# EAGLE schematic A314v1.1 (EAGLE 7.7.0)

## Sheet 1 of 4: AMIGA Interface
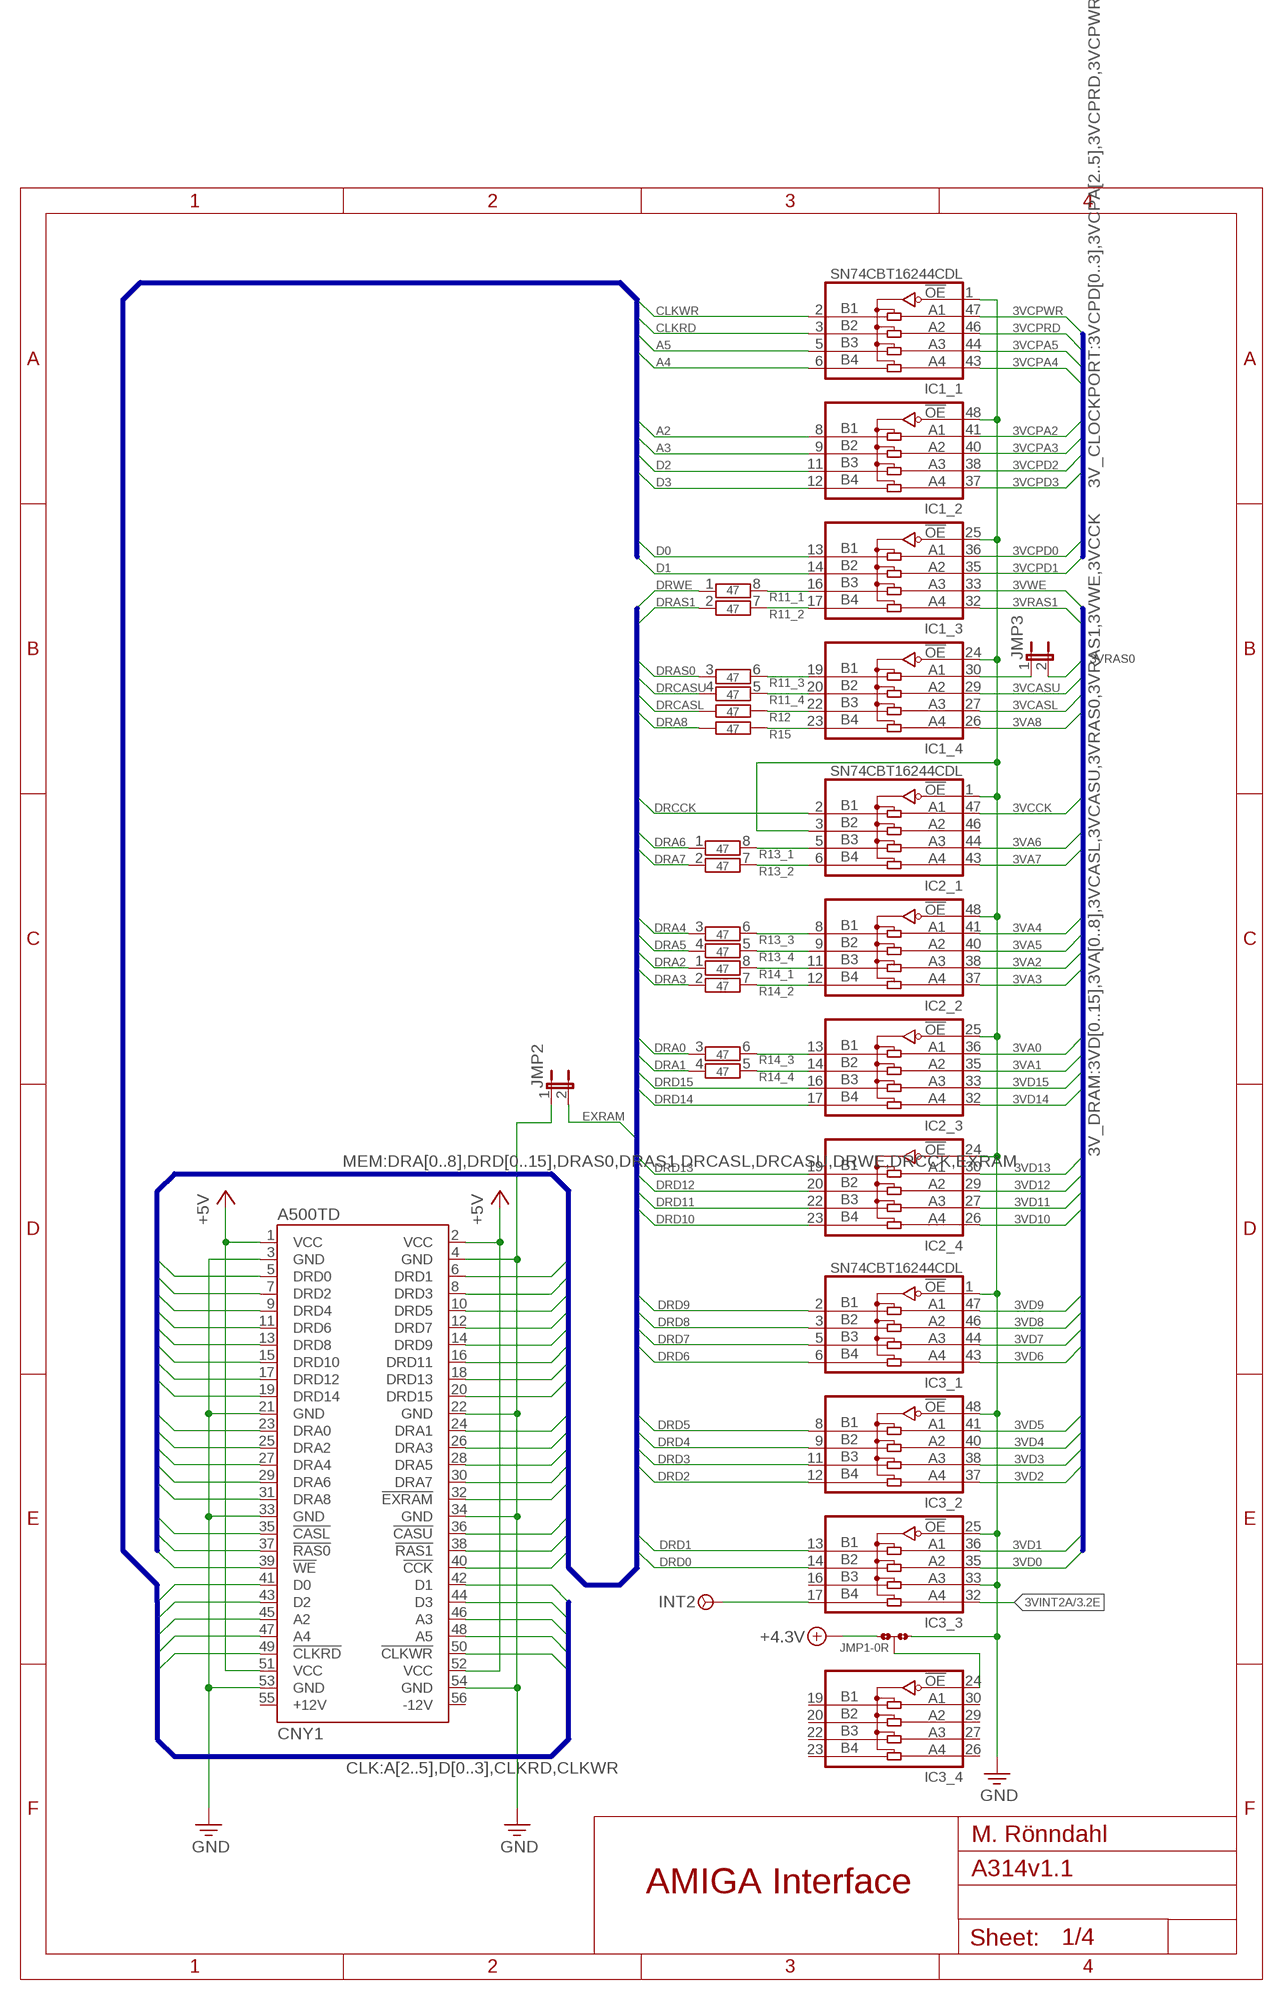
[diagram p0: schematic, sheet 1]

### Parts
CNY1  A500TD  [TRAPDOOR]
IC1  SN74CBT16244CDL  [SSOP-DL48]
IC2  SN74CBT16244CDL  [SSOP-DL48]
IC3  SN74CBT16244CDL  [SSOP-DL48]
INT2  TP1  TP_LITE  [P1-08]
JMP1  0R-JUMPC  [C0R-JMP]
JMP2  JP1E  [JP1]
JMP3  JP1E  [JP1]
R11  47  CTS742C083_S  [CTS742C083]
R12  47  R-EU_R0805  [R0805]
R13  47  CTS742C083_S  [CTS742C083]
R14  47  CTS742C083_S  [CTS742C083]
R15  47  R-EU_R0805  [R0805]

### Nets
3VA0: IC2.36(_3:A1) ; also sheet 3
3VA1: IC2.35(_3:A2) ; also sheet 3
3VA2: IC2.38(_2:A3) ; also sheet 3
3VA3: IC2.37(_2:A4) ; also sheet 3
3VA4: IC2.41(_2:A1) ; also sheet 3
3VA5: IC2.40(_2:A2) ; also sheet 3
3VA6: IC2.44(_1:A3) ; also sheet 3
3VA7: IC2.43(_1:A4) ; also sheet 3
3VA8: IC1.26(_4:A4) ; also sheet 3
3VCASL: IC1.27(_4:A3) ; also sheet 3
3VCASU: IC1.29(_4:A2) ; also sheet 3
3VCCK: IC2.47(_1:A1) ; also sheet 3
3VCPA2: IC1.41(_2:A1) ; also sheet 3
3VCPA3: IC1.40(_2:A2) ; also sheet 3
3VCPA4: IC1.43(_1:A4) ; also sheet 3
3VCPA5: IC1.44(_1:A3) ; also sheet 3
3VCPD0: IC1.36(_3:A1) ; also sheet 3
3VCPD1: IC1.35(_3:A2) ; also sheet 3
3VCPD2: IC1.38(_2:A3) ; also sheet 3
3VCPD3: IC1.37(_2:A4) ; also sheet 3
3VCPRD: IC1.46(_1:A2) ; also sheet 3
3VCPWR: IC1.47(_1:A1) ; also sheet 3
3VD0: IC3.35(_3:A2) ; also sheet 3
3VD1: IC3.36(_3:A1) ; also sheet 3
3VD2: IC3.37(_2:A4) ; also sheet 3
3VD3: IC3.38(_2:A3) ; also sheet 3
3VD4: IC3.40(_2:A2) ; also sheet 3
3VD5: IC3.41(_2:A1) ; also sheet 3
3VD6: IC3.43(_1:A4) ; also sheet 3
3VD7: IC3.44(_1:A3) ; also sheet 3
3VD8: IC3.46(_1:A2) ; also sheet 3
3VD9: IC3.47(_1:A1) ; also sheet 3
3VD10: IC2.26(_4:A4) ; also sheet 3
3VD11: IC2.27(_4:A3) ; also sheet 3
3VD12: IC2.29(_4:A2) ; also sheet 3
3VD13: IC2.30(_4:A1) ; also sheet 3
3VD14: IC2.32(_3:A4) ; also sheet 3
3VD15: IC2.33(_3:A3) ; also sheet 3
3VINT2A: IC3.32(_3:A4) ; also sheet 3
3VRAS0: JMP3.2 ; also sheet 3
3VRAS1: IC1.32(_3:A4) ; also sheet 3
3VWE: IC1.33(_3:A3) ; also sheet 3
+4.3V: IC3.24(_4:!OE) JMP1.1 JMP1.2 ; also sheet 4
+5V: CNY1.1(VCC) CNY1.2(VCC) CNY1.51(VCC) CNY1.52(VCC) ; also sheet 4
A2: CNY1.45(A2) IC1.8(_2:B1)
A3: CNY1.46(A3) IC1.9(_2:B2)
A4: CNY1.47(A4) IC1.6(_1:B4)
A5: CNY1.48(A5) IC1.5(_1:B3)
CLKRD: CNY1.49(!CLKRD) IC1.3(_1:B2)
CLKWR: CNY1.50(!CLKWR) IC1.2(_1:B1)
D0: CNY1.41(D0) IC1.13(_3:B1)
D1: CNY1.42(D1) IC1.14(_3:B2)
D2: CNY1.43(D2) IC1.11(_2:B3)
D3: CNY1.44(D3) IC1.12(_2:B4)
DRA0: CNY1.23(DRA0) R14.3
DRA1: CNY1.24(DRA1) R14.4
DRA2: CNY1.25(DRA2) R14.1
DRA3: CNY1.26(DRA3) R14.2
DRA4: CNY1.27(DRA4) R13.3
DRA5: CNY1.28(DRA5) R13.4
DRA6: CNY1.29(DRA6) R13.1
DRA7: CNY1.30(DRA7) R13.2
DRA8: CNY1.31(DRA8) R15.2
DRA8_L: IC1.23(_4:B4) R15.1
DRAS0: CNY1.37(!RAS0) R11.3
DRAS0_L: IC1.19(_4:B1) R11.6
DRAS1: CNY1.38(!RAS1) R11.2
DRAS1_L: IC1.17(_3:B4) R11.7
DRCASL: CNY1.35(!CASL) R12.2
DRCASL_L: IC1.22(_4:B3) R12.1
DRCASU: CNY1.36(!CASU) R11.4
DRCASU_L: IC1.20(_4:B2) R11.5
DRCCK: CNY1.40(!CCK) IC2.2(_1:B1)
DRD0: CNY1.5(DRD0) IC3.14(_3:B2)
DRD1: CNY1.6(DRD1) IC3.13(_3:B1)
DRD2: CNY1.7(DRD2) IC3.12(_2:B4)
DRD3: CNY1.8(DRD3) IC3.11(_2:B3)
DRD4: CNY1.9(DRD4) IC3.9(_2:B2)
DRD5: CNY1.10(DRD5) IC3.8(_2:B1)
DRD6: CNY1.11(DRD6) IC3.6(_1:B4)
DRD7: CNY1.12(DRD7) IC3.5(_1:B3)
DRD8: CNY1.13(DRD8) IC3.3(_1:B2)
DRD9: CNY1.14(DRD9) IC3.2(_1:B1)
DRD10: CNY1.15(DRD10) IC2.23(_4:B4)
DRD11: CNY1.16(DRD11) IC2.22(_4:B3)
DRD12: CNY1.17(DRD12) IC2.20(_4:B2)
DRD13: CNY1.18(DRD13) IC2.19(_4:B1)
DRD14: CNY1.19(DRD14) IC2.17(_3:B4)
DRD15: CNY1.20(DRD15) IC2.16(_3:B3)
DRWE: CNY1.39(!WE) R11.1
DRWE_L: IC1.16(_3:B3) R11.8
EXRAM: CNY1.32(!EXRAM) JMP2.2
GND: CNY1.3(GND) CNY1.4(GND) CNY1.21(GND) CNY1.22(GND) CNY1.33(GND) CNY1.34(GND) CNY1.53(GND) CNY1.54(GND) IC1.1(_1:!OE) IC1.24(_4:!OE) IC1.25(_3:!OE) IC1.48(_2:!OE) IC2.1(_1:!OE) IC2.3(_1:B2) IC2.24(_4:!OE) IC2.25(_3:!OE) IC2.48(_2:!OE) IC3.1(_1:!OE) IC3.25(_3:!OE) IC3.33(_3:A3) IC3.48(_2:!OE) JMP1.3 JMP2.1 ; also sheet 2,3,4
INT2A: IC3.17(_3:B4) INT2.TP
N$5: IC1.30(_4:A1) JMP3.1
N$9: IC2.14(_3:B2) R14.5
N$10: IC2.13(_3:B1) R14.6
N$11: IC2.12(_2:B4) R14.7
N$12: IC2.11(_2:B3) R14.8
N$13: IC2.9(_2:B2) R13.5
N$14: IC2.8(_2:B1) R13.6
N$15: IC2.6(_1:B4) R13.7
N$16: IC2.5(_1:B3) R13.8
Unconnected: CNY1.55(+12V) CNY1.56(-12V) IC2.46(_1:A2) IC3.16(_3:B3) IC3.19(_4:B1) IC3.20(_4:B2) IC3.22(_4:B3) IC3.23(_4:B4) IC3.26(_4:A4) IC3.27(_4:A3) IC3.29(_4:A2) IC3.30(_4:A1)

### Buses
CLK:A[2..5],D[0..3],CLKRD,CLKWR
MEM:DRA[0..8],DRD[0..15],DRAS0,DRAS1,DRCASL,DRCASU,DRWE,DRCCK,EXRAM
3V_DRAM:3VD[0..15],3VA[0..8],3VCASL,3VCASU,3VRAS0,3VRAS1,3VWE,3VCCK
3V_CLOCKPORT:3VCPD[0..3],3VCPA[2..5],3VCPRD,3VCPWR

### Notes on the sheet
- M. Rönndahl
- AMIGA Interface

## Sheet 2 of 4: SRAM & RTC
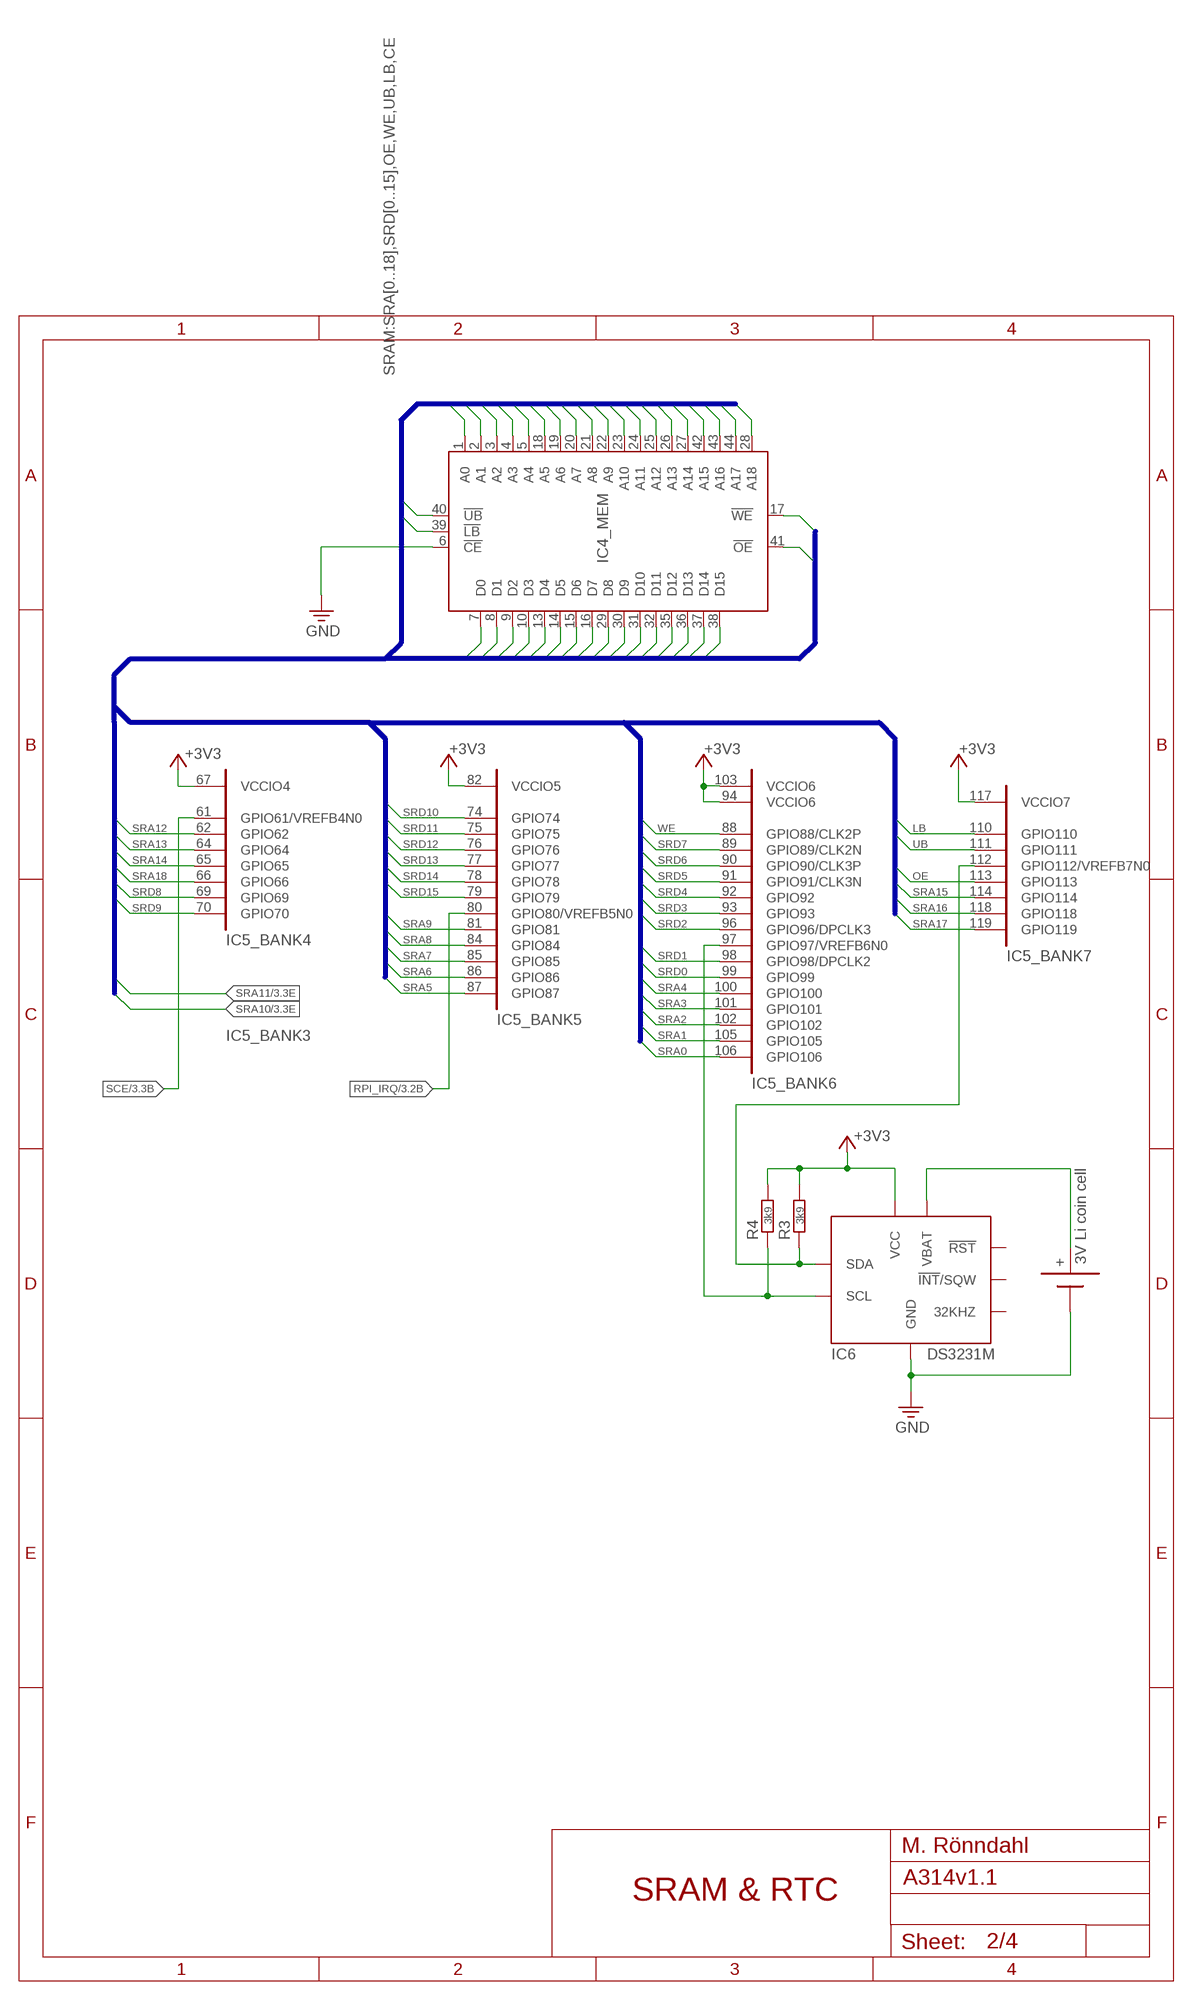
[diagram p1: schematic, sheet 2]

### Parts
BAT1  CR2025/CR2032TH  [LINX20XX-THM]
IC4  IS61WV51216BLL-10TLI  [TSOP-2]
IC5  10M08SCE144  [SQFP-S-20X20-144]
IC6  DS3231M  [SOIC8]
R3  3k9  R-EU_R0805  [R0805]
R4  3k9  R-EU_R0805  [R0805]

### Nets
+: BAT1.+@1(+) BAT1.+@2(+) BAT1.+@3(+) BAT1.+@4(+) IC6.6(VBAT)
+3V3: IC5.67(_BANK4:VCCIO4) IC5.82(_BANK5:VCCIO5) IC5.94(_BANK6:VCCIO6) IC5.103(_BANK6:VCCIO6) IC5.117(_BANK7:VCCIO7) IC6.2(VCC) R3.2 R4.2 ; also sheet 3,4
GND: BAT1.GND(-) IC4.6(_MEM:!CE) IC6.5(GND) ; also sheet 1,3,4
LB: IC4.39(_MEM:!LB) IC5.110(_BANK7:GPIO110)
OE: IC4.41(_MEM:!OE) IC5.113(_BANK7:GPIO113)
RPI_IRQ: IC5.80(_BANK5:GPIO80/VREFB5N0) ; also sheet 3
SCE: IC5.61(_BANK4:GPIO61/VREFB4N0) ; also sheet 3
SCL: IC5.97(_BANK6:GPIO97/VREFB6N0) IC6.8(SCL) R4.1
SDA: IC5.112(_BANK7:GPIO112/VREFB7N0) IC6.7(SDA) R3.1
SRA0: IC4.1(_MEM:A0) IC5.106(_BANK6:GPIO106)
SRA1: IC4.2(_MEM:A1) IC5.105(_BANK6:GPIO105)
SRA2: IC4.3(_MEM:A2) IC5.102(_BANK6:GPIO102)
SRA3: IC4.4(_MEM:A3) IC5.101(_BANK6:GPIO101)
SRA4: IC4.5(_MEM:A4) IC5.100(_BANK6:GPIO100)
SRA5: IC4.18(_MEM:A5) IC5.87(_BANK5:GPIO87)
SRA6: IC4.19(_MEM:A6) IC5.86(_BANK5:GPIO86)
SRA7: IC4.20(_MEM:A7) IC5.85(_BANK5:GPIO85)
SRA8: IC4.21(_MEM:A8) IC5.84(_BANK5:GPIO84)
SRA9: IC4.22(_MEM:A9) IC5.81(_BANK5:GPIO81)
SRA10: IC4.23(_MEM:A10) ; also sheet 3
SRA11: IC4.24(_MEM:A11) ; also sheet 3
SRA12: IC4.25(_MEM:A12) IC5.62(_BANK4:GPIO62)
SRA13: IC4.26(_MEM:A13) IC5.64(_BANK4:GPIO64)
SRA14: IC4.27(_MEM:A14) IC5.65(_BANK4:GPIO65)
SRA15: IC4.42(_MEM:A15) IC5.114(_BANK7:GPIO114)
SRA16: IC4.43(_MEM:A16) IC5.118(_BANK7:GPIO118)
SRA17: IC4.44(_MEM:A17) IC5.119(_BANK7:GPIO119)
SRA18: IC4.28(_MEM:A18) IC5.66(_BANK4:GPIO66)
SRD0: IC4.7(_MEM:D0) IC5.99(_BANK6:GPIO99)
SRD1: IC4.8(_MEM:D1) IC5.98(_BANK6:GPIO98/DPCLK2)
SRD2: IC4.9(_MEM:D2) IC5.96(_BANK6:GPIO96/DPCLK3)
SRD3: IC4.10(_MEM:D3) IC5.93(_BANK6:GPIO93)
SRD4: IC4.13(_MEM:D4) IC5.92(_BANK6:GPIO92)
SRD5: IC4.14(_MEM:D5) IC5.91(_BANK6:GPIO91/CLK3N)
SRD6: IC4.15(_MEM:D6) IC5.90(_BANK6:GPIO90/CLK3P)
SRD7: IC4.16(_MEM:D7) IC5.89(_BANK6:GPIO89/CLK2N)
SRD8: IC4.29(_MEM:D8) IC5.69(_BANK4:GPIO69)
SRD9: IC4.30(_MEM:D9) IC5.70(_BANK4:GPIO70)
SRD10: IC4.31(_MEM:D10) IC5.74(_BANK5:GPIO74)
SRD11: IC4.32(_MEM:D11) IC5.75(_BANK5:GPIO75)
SRD12: IC4.35(_MEM:D12) IC5.76(_BANK5:GPIO76)
SRD13: IC4.36(_MEM:D13) IC5.77(_BANK5:GPIO77)
SRD14: IC4.37(_MEM:D14) IC5.78(_BANK5:GPIO78)
SRD15: IC4.38(_MEM:D15) IC5.79(_BANK5:GPIO79)
UB: IC4.40(_MEM:!UB) IC5.111(_BANK7:GPIO111)
WE: IC4.17(_MEM:!WE) IC5.88(_BANK6:GPIO88/CLK2P)
Unconnected: IC6.1(32KHZ) IC6.3(!INT!/SQW) IC6.4(!RST)

### Buses
SRAM:SRA[0..18],SRD[0..15],OE,WE,UB,LB,CE

### Notes on the sheet
- IC5_BANK3
- 3V Li coin cell
- M. Rönndahl
- SRAM & RTC

## Sheet 3 of 4: Raspberry & DRAM Bus
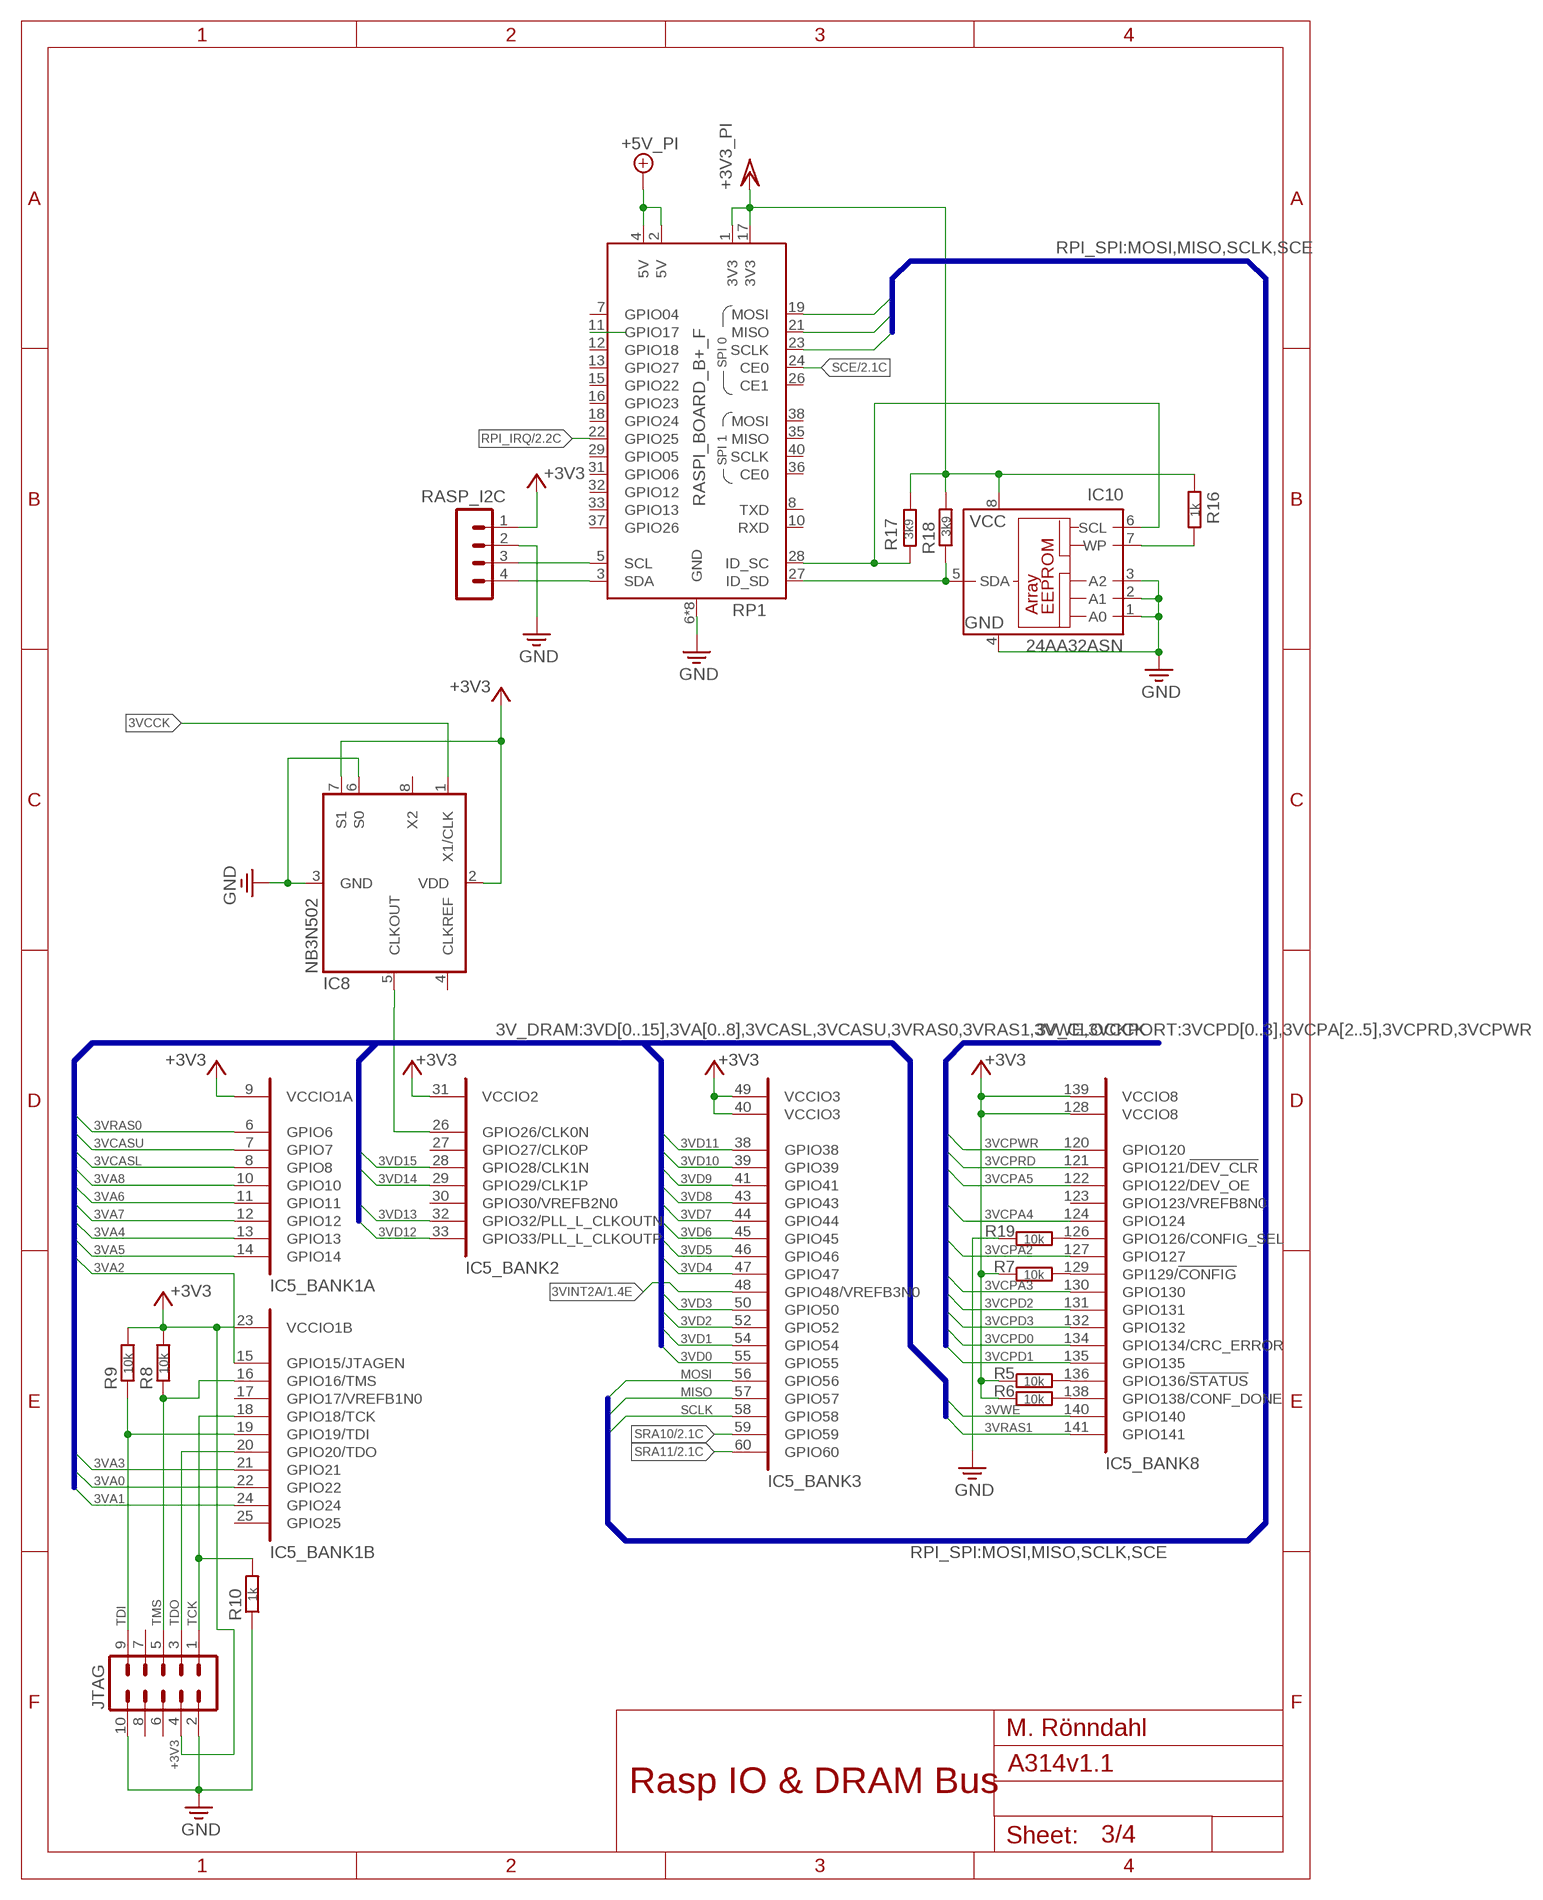
[diagram p2: schematic, sheet 3]

### Parts
IC8  NB3N502  [SO08]
IC10  24AA32ASN  [SO-08]
JTAG  MA05-2  [MA05-2]
R5  10k  R-EU_R0805  [R0805]
R6  10k  R-EU_R0805  [R0805]
R7  10k  R-EU_R0805  [R0805]
R8  10k  R-EU_R0805  [R0805]
R9  10k  R-EU_R0805  [R0805]
R10  1k  R-EU_R0805  [R0805]
R16  1k  R-EU_R0805  [R0805]
R17  3k9  R-EU_R0805  [R0805]
R18  3k9  R-EU_R0805  [R0805]
R19  10k  R-EU_R0805  [R0805]
RASP_I2C  MA04-1  [MA04-1]
RP1  RASPI_BOARD_B+_F  [RASPI_BOARD_B+_FULL]

### Nets
3VA0: IC5.22(_BANK1B:GPIO22) ; also sheet 1
3VA1: IC5.24(_BANK1B:GPIO24) ; also sheet 1
3VA2: IC5.15(_BANK1B:GPIO15/JTAGEN) ; also sheet 1
3VA3: IC5.21(_BANK1B:GPIO21) ; also sheet 1
3VA4: IC5.13(_BANK1A:GPIO13) ; also sheet 1
3VA5: IC5.14(_BANK1A:GPIO14) ; also sheet 1
3VA6: IC5.11(_BANK1A:GPIO11) ; also sheet 1
3VA7: IC5.12(_BANK1A:GPIO12) ; also sheet 1
3VA8: IC5.10(_BANK1A:GPIO10) ; also sheet 1
3VCASL: IC5.8(_BANK1A:GPIO8) ; also sheet 1
3VCASU: IC5.7(_BANK1A:GPIO7) ; also sheet 1
3VCCK: IC8.1(X1/CLK) ; also sheet 1
3VCPA2: IC5.127(_BANK8:GPIO127) ; also sheet 1
3VCPA3: IC5.130(_BANK8:GPIO130) ; also sheet 1
3VCPA4: IC5.124(_BANK8:GPIO124) ; also sheet 1
3VCPA5: IC5.122(_BANK8:GPIO122/DEV_OE) ; also sheet 1
3VCPD0: IC5.134(_BANK8:GPIO134/CRC_ERROR) ; also sheet 1
3VCPD1: IC5.135(_BANK8:GPIO135) ; also sheet 1
3VCPD2: IC5.131(_BANK8:GPIO131) ; also sheet 1
3VCPD3: IC5.132(_BANK8:GPIO132) ; also sheet 1
3VCPRD: IC5.121(_BANK8:GPIO121/!DEV_CLR) ; also sheet 1
3VCPWR: IC5.120(_BANK8:GPIO120) ; also sheet 1
3VD0: IC5.55(_BANK3:GPIO55) ; also sheet 1
3VD1: IC5.54(_BANK3:GPIO54) ; also sheet 1
3VD2: IC5.52(_BANK3:GPIO52) ; also sheet 1
3VD3: IC5.50(_BANK3:GPIO50) ; also sheet 1
3VD4: IC5.47(_BANK3:GPIO47) ; also sheet 1
3VD5: IC5.46(_BANK3:GPIO46) ; also sheet 1
3VD6: IC5.45(_BANK3:GPIO45) ; also sheet 1
3VD7: IC5.44(_BANK3:GPIO44) ; also sheet 1
3VD8: IC5.43(_BANK3:GPIO43) ; also sheet 1
3VD9: IC5.41(_BANK3:GPIO41) ; also sheet 1
3VD10: IC5.39(_BANK3:GPIO39) ; also sheet 1
3VD11: IC5.38(_BANK3:GPIO38) ; also sheet 1
3VD12: IC5.33(_BANK2:GPIO33/PLL_L_CLKOUTP) ; also sheet 1
3VD13: IC5.32(_BANK2:GPIO32/PLL_L_CLKOUTN) ; also sheet 1
3VD14: IC5.29(_BANK2:GPIO29/CLK1P) ; also sheet 1
3VD15: IC5.28(_BANK2:GPIO28/CLK1N) ; also sheet 1
3VINT2A: IC5.48(_BANK3:GPIO48/VREFB3N0) ; also sheet 1
3VRAS0: IC5.6(_BANK1A:GPIO6) ; also sheet 1
3VRAS1: IC5.141(_BANK8:GPIO141) ; also sheet 1
3VWE: IC5.140(_BANK8:GPIO140) ; also sheet 1
14MHZ: IC5.26(_BANK2:GPIO26/CLK0N) IC8.5(CLKOUT)
!CFG: IC5.129(_BANK8:GPI129/!CONFIG) R7.2
!STAT: IC5.136(_BANK8:GPIO136/!STATUS) R5.2
+3V3: IC5.9(_BANK1A:VCCIO1A) IC5.23(_BANK1B:VCCIO1B) IC5.31(_BANK2:VCCIO2) IC5.40(_BANK3:VCCIO3) IC5.49(_BANK3:VCCIO3) IC5.128(_BANK8:VCCIO8) IC5.139(_BANK8:VCCIO8) IC8.2(VDD) IC8.7(S1) JTAG.4 R5.1 R6.1 R7.1 R8.2 R9.2 RASP_I2C.1 ; also sheet 2,4
+5V/1: RP1.2(5V) RP1.4(5V) ; supply symbol labelled +5V_PI ; also sheet 4
CFG_DNE: IC5.138(_BANK8:GPIO138/CONF_DONE) R6.2
CFG_SEL: IC5.126(_BANK8:GPIO126/CONFIG_SEL) R19.2
GND: IC8.3(GND) IC8.6(S0) IC10.1(A0) IC10.2(A1) IC10.3(A2) IC10.4(GND) JTAG.2 JTAG.10 R10.1 R19.1 RASP_I2C.2 RP1.6(GND) RP1.9(GND) RP1.14(GND) RP1.20(GND) RP1.25(GND) RP1.30(GND) RP1.34(GND) RP1.39(GND) ; also sheet 1,2,4
HAT_SCL: IC10.6(SCL) R17.2 RP1.28(ID_SC)
HAT_SDA: IC10.5(SDA) R18.1 RP1.27(ID_SD)
IRQ: RP1.11(GPIO17)
MISO: IC5.57(_BANK3:GPIO57) RP1.21(MISO)
MOSI: IC5.56(_BANK3:GPIO56) RP1.19(MOSI)
PI_SCL: RASP_I2C.3 RP1.5(SCL)
PI_SDA: RASP_I2C.4 RP1.3(SDA)
RPI_IRQ: RP1.22(GPIO25) ; also sheet 2
SCE: RP1.24(CE0) ; also sheet 2
SCLK: IC5.58(_BANK3:GPIO58) RP1.23(SCLK)
SRA10: IC5.59(_BANK3:GPIO59) ; also sheet 2
SRA11: IC5.60(_BANK3:GPIO60) ; also sheet 2
TCK: IC5.18(_BANK1B:GPIO18/TCK) JTAG.1 R10.2
TDI: IC5.19(_BANK1B:GPIO19/TDI) JTAG.9 R9.1
TDO: IC5.20(_BANK1B:GPIO20/TDO) JTAG.3
TMS: IC5.16(_BANK1B:GPIO16/TMS) JTAG.5 R8.1
VCC/2: IC10.8(VCC) R16.2 R17.1 R18.2 RP1.1(3V3) RP1.17(3V3) ; supply symbol labelled +3V3_PI ; also sheet 4
WP: IC10.7(WP) R16.1
Unconnected: IC5.17(_BANK1B:GPIO17/VREFB1N0) IC5.25(_BANK1B:GPIO25) IC5.27(_BANK2:GPIO27/CLK0P) IC5.30(_BANK2:GPIO30/VREFB2N0) IC5.123(_BANK8:GPIO123/VREFB8N0) IC8.4(CLKREF) IC8.8(X2) JTAG.6 JTAG.7 JTAG.8 RP1.7(GPIO04) RP1.8(TXD) RP1.10(RXD) RP1.12(GPIO18) RP1.13(GPIO27) RP1.15(GPIO22) RP1.16(GPIO23) RP1.18(GPIO24) RP1.26(CE1) RP1.29(GPIO05) RP1.31(GPIO06) RP1.32(GPIO12) RP1.33(GPIO13) RP1.35(MISO) RP1.36(CE0) RP1.37(GPIO26) RP1.38(MOSI) RP1.40(SCLK)

### Buses
RPI_SPI:MOSI,MISO,SCLK,SCE
3V_CLOCKPORT:3VCPD[0..3],3VCPA[2..5],3VCPRD,3VCPWR
3V_DRAM:3VD[0..15],3VA[0..8],3VCASL,3VCASU,3VRAS0,3VRAS1,3VWE,3VCCK

### Notes on the sheet
- M. Rönndahl
- Rasp IO & DRAM Bus

## Sheet 4 of 4: Power and decoupling
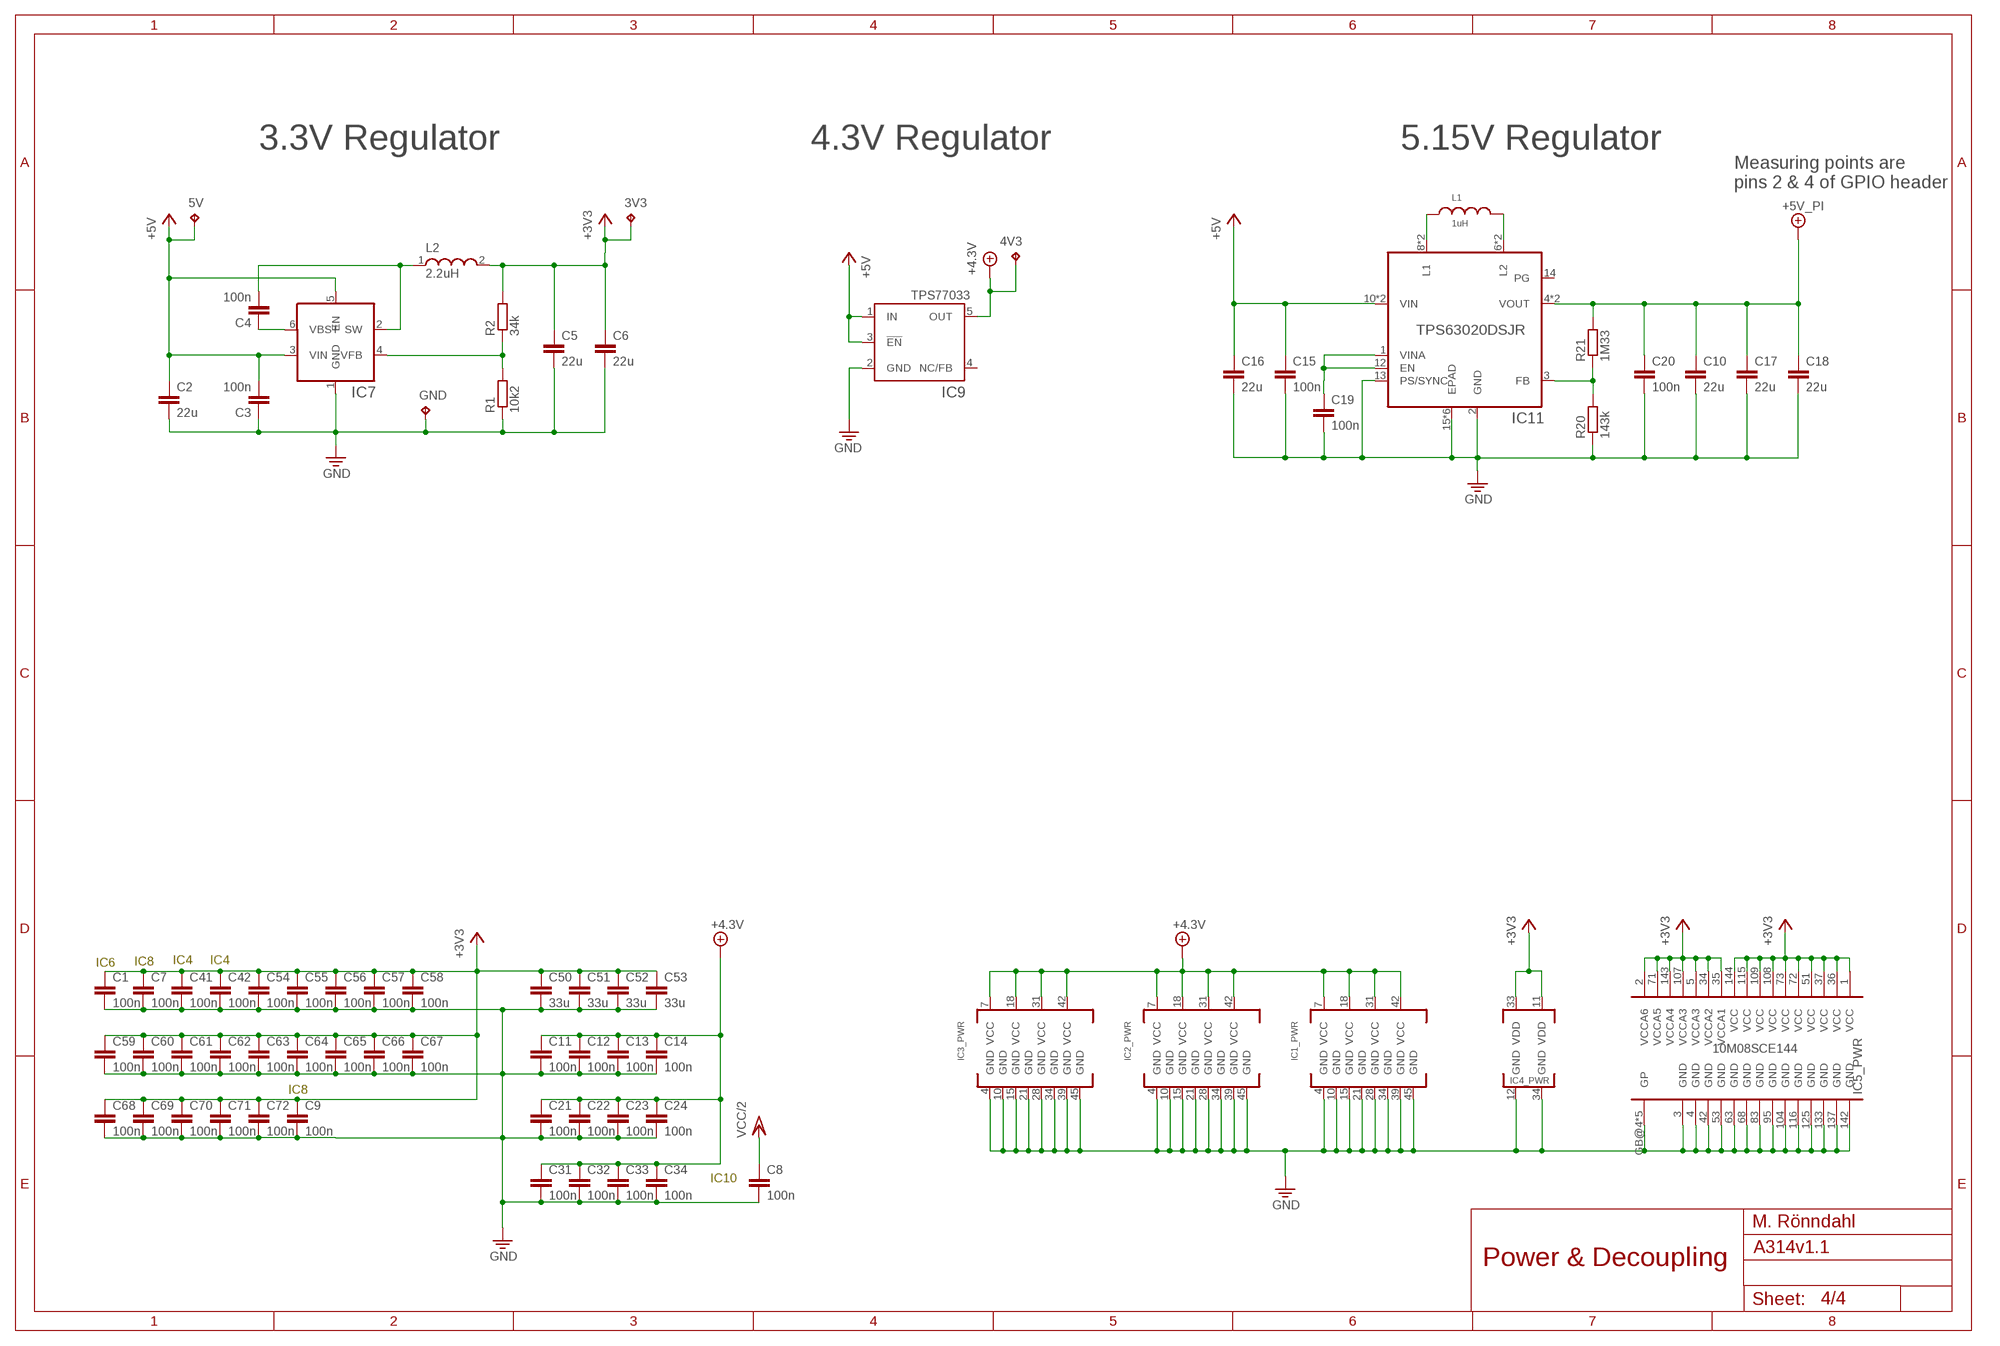
[diagram p3: schematic, sheet 4]

### Parts
3V3  TPPAD1-13  [P1-13]
4V3  TPPAD1-13  [P1-13]
5V  TPPAD1-13  [P1-13]
C1  100n  C-EUC0805  [C0805]
C2  22u  C-EUC1812K  [C1812K]
C3  100n  C-EUC0805  [C0805]
C4  100n  C-EUC0805  [C0805]
C5  22u  C-EUC1812K  [C1812K]
C6  22u  C-EUC1812K  [C1812K]
C7  100n  C-EUC0805  [C0805]
C8  100n  C-EUC0805  [C0805]
C9  100n  C-EUC0805  [C0805]
C10  22u  C-EUC1812K  [C1812K]
C11  100n  C-EUC0805  [C0805]
C12  100n  C-EUC0805  [C0805]
C13  100n  C-EUC0805  [C0805]
C14  100n  C-EUC0805  [C0805]
C15  100n  C-EUC0805  [C0805]
C16  22u  C-EUC1812K  [C1812K]
C17  22u  C-EUC1812K  [C1812K]
C18  22u  C-EUC1812K  [C1812K]
C19  100n  C-EUC0805  [C0805]
C20  100n  C-EUC0805  [C0805]
C21  100n  C-EUC0805  [C0805]
C22  100n  C-EUC0805  [C0805]
C23  100n  C-EUC0805  [C0805]
C24  100n  C-EUC0805  [C0805]
C31  100n  C-EUC0805  [C0805]
C32  100n  C-EUC0805  [C0805]
C33  100n  C-EUC0805  [C0805]
C34  100n  C-EUC0805  [C0805]
C41  100n  C-EUC0805  [C0805]
C42  100n  C-EUC0805  [C0805]
C50  33u  C-EUC0805  [C0805]
C51  33u  C-EUC0805  [C0805]
C52  33u  C-EUC0805  [C0805]
C53  33u  C-EUC0805  [C0805]
C54  100n  C-EUC0805  [C0805]
C55  100n  C-EUC0805  [C0805]
C56  100n  C-EUC0805  [C0805]
C57  100n  C-EUC0805  [C0805]
C58  100n  C-EUC0805  [C0805]
C59  100n  C-EUC0805  [C0805]
C60  100n  C-EUC0805  [C0805]
C61  100n  C-EUC0805  [C0805]
C62  100n  C-EUC0805  [C0805]
C63  100n  C-EUC0805  [C0805]
C64  100n  C-EUC0805  [C0805]
C65  100n  C-EUC0805  [C0805]
C66  100n  C-EUC0805  [C0805]
C67  100n  C-EUC0805  [C0805]
C68  100n  C-EUC0805  [C0805]
C69  100n  C-EUC0805  [C0805]
C70  100n  C-EUC0805  [C0805]
C71  100n  C-EUC0805  [C0805]
C72  100n  C-EUC0805  [C0805]
GND  TPPAD1-13  [P1-13]
IC7  TPS565208DDC  [THIN_SO23]
IC9  TPS77033  [SOT23-DBV]
IC11  TPS63020DSJR  [DSJ14_2P85X1P58]
L1  1uH  WE-TPC_6823_744062001  [WE-TPC_6823]
L2  2.2uH  WE-TPC_1028/1038  [WE-TPC_1028/1038]
R1  10k2  R-EU_R0805  [R0805]
R2  34k  R-EU_R0805  [R0805]
R20  143k  R-EU_R0805  [R0805]
R21  1M33  R-EU_R0805  [R0805]

### Nets
+3V3: 3V3.TP C1.1 C5.1 C6.1 C7.1 C9.1 C41.1 C42.1 C50.1 C51.1 C52.1 C53.1 C54.1 C55.1 C56.1 C57.1 C58.1 C59.1 C60.1 C61.1 C62.1 C63.1 C64.1 C65.1 C66.1 C67.1 C68.1 C69.1 C70.1 C71.1 C72.1 IC4.11(_PWR:VDD) IC4.33(_PWR:VDD) IC5.1(_PWR:VCC) IC5.2(_PWR:VCCA6) IC5.5(_PWR:VCCA3) IC5.34(_PWR:VCCA2) IC5.35(_PWR:VCCA1) IC5.36(_PWR:VCC) IC5.37(_PWR:VCC) IC5.51(_PWR:VCC) IC5.71(_PWR:VCCA5) IC5.72(_PWR:VCC) IC5.73(_PWR:VCC) IC5.107(_PWR:VCCA3) IC5.108(_PWR:VCC) IC5.109(_PWR:VCC) IC5.115(_PWR:VCC) IC5.143(_PWR:VCCA4) IC5.144(_PWR:VCC) L2.2 R2.2 ; also sheet 2,3
+4.3V: 4V3.TP C11.1 C12.1 C13.1 C14.1 C21.1 C22.1 C23.1 C24.1 C31.1 C32.1 C33.1 C34.1 IC1.7(_PWR:VCC) IC1.18(_PWR:VCC) IC1.31(_PWR:VCC) IC1.42(_PWR:VCC) IC2.7(_PWR:VCC) IC2.18(_PWR:VCC) IC2.31(_PWR:VCC) IC2.42(_PWR:VCC) IC3.7(_PWR:VCC) IC3.18(_PWR:VCC) IC3.31(_PWR:VCC) IC3.42(_PWR:VCC) IC9.5(OUT) ; also sheet 1
+5V: 5V.TP C2.1 C3.2 C15.2 C16.1 IC7.3(VIN) IC7.5(EN) IC9.1(IN) IC9.3(!EN) IC11.10(VIN) IC11.11(VIN) ; also sheet 1
+5V/1: C10.1 C17.1 C18.1 C20.2 IC11.4(VOUT) IC11.5(VOUT) R21.2 ; supply symbol labelled +5V_PI ; also sheet 3
BST1: C4.1 IC7.6(VBST)
FB1: IC7.4(VFB) R1.2 R2.1
FB2: IC11.3(FB) R20.2 R21.1
GND: C1.2 C2.2 C3.1 C5.2 C6.2 C7.2 C8.2 C9.2 C10.2 C11.2 C12.2 C13.2 C14.2 C15.1 C16.2 C17.2 C18.2 C19.1 C20.1 C21.2 C22.2 C23.2 C24.2 C31.2 C32.2 C33.2 C34.2 C41.2 C42.2 C50.2 C51.2 C52.2 C53.2 C54.2 C55.2 C56.2 C57.2 C58.2 C59.2 C60.2 C61.2 C62.2 C63.2 C64.2 C65.2 C66.2 C67.2 C68.2 C69.2 C70.2 C71.2 C72.2 GND.TP IC1.4(_PWR:GND) IC1.10(_PWR:GND) IC1.15(_PWR:GND) IC1.21(_PWR:GND) IC1.28(_PWR:GND) IC1.34(_PWR:GND) IC1.39(_PWR:GND) IC1.45(_PWR:GND) IC2.4(_PWR:GND) IC2.10(_PWR:GND) IC2.15(_PWR:GND) IC2.21(_PWR:GND) IC2.28(_PWR:GND) IC2.34(_PWR:GND) IC2.39(_PWR:GND) IC2.45(_PWR:GND) IC3.4(_PWR:GND) IC3.10(_PWR:GND) IC3.15(_PWR:GND) IC3.21(_PWR:GND) IC3.28(_PWR:GND) IC3.34(_PWR:GND) IC3.39(_PWR:GND) IC3.45(_PWR:GND) IC4.12(_PWR:GND) IC4.34(_PWR:GND) IC5.3(_PWR:GND) IC5.4(_PWR:GND) IC5.42(_PWR:GND) IC5.53(_PWR:GND) IC5.63(_PWR:GND) IC5.68(_PWR:GND) IC5.83(_PWR:GND) IC5.95(_PWR:GND) IC5.104(_PWR:GND) IC5.116(_PWR:GND) IC5.125(_PWR:GND) IC5.133(_PWR:GND) IC5.137(_PWR:GND) IC5.142(_PWR:GND) IC5.GB@4(_PWR:GP) IC5.GP@1(_PWR:GP) IC5.GP@2(_PWR:GP) IC5.GP@3(_PWR:GP) IC5.GP@5(_PWR:GP) IC7.1(GND) IC9.2(GND) IC11.2(GND) IC11.13(PS/SYNC) IC11.15(EPAD) IC11.V_1(EPAD) IC11.V_2(EPAD) IC11.V_3(EPAD) IC11.V_4(EPAD) IC11.V_5(EPAD) R1.1 R20.1 ; also sheet 1,2,3
L1: IC11.8(L1) IC11.9(L1) L1.1
L2: IC11.6(L2) IC11.7(L2) L1.2
SW: C4.2 IC7.2(SW) L2.1
VCC/2: C8.1 ; also sheet 3
VINA: C19.2 IC11.1(VINA) IC11.12(EN)
Unconnected: IC9.4(NC/FB) IC11.14(PG)

### Notes on the sheet
- 3.3V Regulator | 4.3V Regulator | 5.15V Regulator
- Measuring points are
  pins 2 & 4 of GPIO header
- IC6 | IC8 | IC4 | IC4
- IC8
- IC10
- M. Rönndahl
- Power & Decoupling

## Library data of the parts
3V3 4V3 5V GND = testpad:TP: Test pad
BAT1 = bat-holder:CR2025/CR2032TH: Link technologies BAT-HLD-001-THM; MOUSER: 712-BAT-HLD-001-THM
C1 C3 C4 C7-C9 C11-C15 C19-C24 C31-C34 C41 C42 C50-C72 = rcl:C-EU: CAPACITOR, European symbol
C2 C5 C6 C10 C16-C18 = rcl:C-EU: CAPACITOR, European symbol; MOUSER: 810-CGA8P1X7R1E226M
CNY1 = commodore:A500TD: A500 Trap Door component including partial board outline; DIGIKEY: SAM1215-28-ND; FARNELL: 1807617; SAMTECH: SSW-128-02-G-D-RA
IC1-IC3 = ti-levelshift:SN74CBT16244C: 16-Bit FET Bus Switch with -2 V Undershoot Protection; MOUSER: 595-SN74CBT16244CDL
IC4 = memory-issi:IS61WV51216BLL: 512K x 16 HIGH-SPEED ASYNCHRONOUS CMOS STATIC RAM; MOUSER: 870-61WV51216B10TLI
IC5 = FPGA-Intel:10M08SC: MAX 10 non-volatile FPGA; MOUSER: 989-10M08SCE144C8G
IC6 = i2c_clock:DS3231M: ±5ppm, I2C Real-Time Clock
IC7 = pwr-ti:TPS565208: 4.5-V to 17-V Input, 5-A Synchronous Step-Down Voltage Regulator; MOUSER: 595-TPS565208DDCR
IC8 = ONsemi:NB3N502: 14 MHz to 190 MHz PLL Clock Multiplier
IC9 = pwr-ti:TPS770*: ULTRALOW-POWER 50-mA LOW-DROPOUT LINEAR REGULATORS 50-mA Low-Dropout Regulator Source: http://focus.ti.com/lit/ds/symlink/tps77001.pdf; MF: TEXAS INSTRUMENTS; MPN: TPS77033DBVT; OC_FARNELL: 8461570; OC_NEWARK: 77C1187
IC10 = microchip:24*: Serial EEPROM I2C; MF: MICROCHIP; MPN: 24AA32A-I/SN; OC_FARNELL: 1617659; OC_NEWARK: 83C5815
IC11 = pwr-ti:TPS63020DSJR: High efficiency single inductor buck-boost converter with 4-A switches; MANUFACTURER_PART_NUMBER: TPS63020DSJR; VENDOR: Texas Instruments
INT2 = testpad:TP_LITE: Simple testpoint or solderpad
JMP1 = jump-0r-smd:0R-JUMP: SMD 0R 0805 Jumper
JMP2 JMP3 = jumper:JP1E: JUMPER
JTAG = con-lstb:MA05-2: PIN HEADER; OC_FARNELL: unknown; OC_NEWARK: unknown
L1 = Würth_PowerMagnetics:WE-TPC_6823: SMD Shielded Tiny Power Inductor Characteristics Extremely flat power inductor High current capability Magnetically shielded which results in a low leakage field Operating temperature: –40 °C to +125 °C Applications Portable power like PDA, digital camera, PCMCIA cards and displays DC/DC converter Embedded PC Mobile data gathering, telemetric <http://katalog.we-online.de/media/images/v2/WE-TPC_Gruppe_2.jpg> Details see: http://katalog.we-online.de/en/pbs/WE-TPC? Updated by Yingchun,Shan 2017-06-26 2017(C) Wurth Elektronik; WE-NUMBER: 744062001/1uH
L2 = Wurth_power_magnetics:WE-TPC: SMD Shielded Tiny Power Inductor Characteristics Extremely flat power inductor High current capability Magnetically shielded which results in a low leakage field Operating temperature: –40 °C to +125 °C Applications Portable power like PDA, digital camera, PCMCIA cards and displays DC/DC converter Embedded PC Mobile data gathering, telemetric <http://katalog.we-online.de/media/images/eisos/IndTPC_pf2.jpg> Details see: http://katalog.we-online.de/en/pbs/WE-TPC? Updated by Dan Xu 2014-07-11 2014 (C) Wurth Elektronik; MOUSER: 710-7440650022
R1-R10 R12 R15-R21 = rcl:R-EU_: RESISTOR, European symbol
R11 R13 R14 = resistor-net:CTS742C083_S: Chip Resistor Array 4 Single Resistor Source: http://www.ctscorp.com/components/Datasheets/CTSChipArrayDs.pdf
RASP_I2C = con-lstb:MA04-1: PIN HEADER; OC_FARNELL: unknown; OC_NEWARK: unknown
RP1 = con-various:RASPI_BOARD_B+: Raspberry Pi GPIO connector with markings for the outer dimensions of the Raspberry Pi board model B+ with all major components identified